# EAGLE design isstracker (EAGLE 9.6.2)

## Sheet 1 of 2
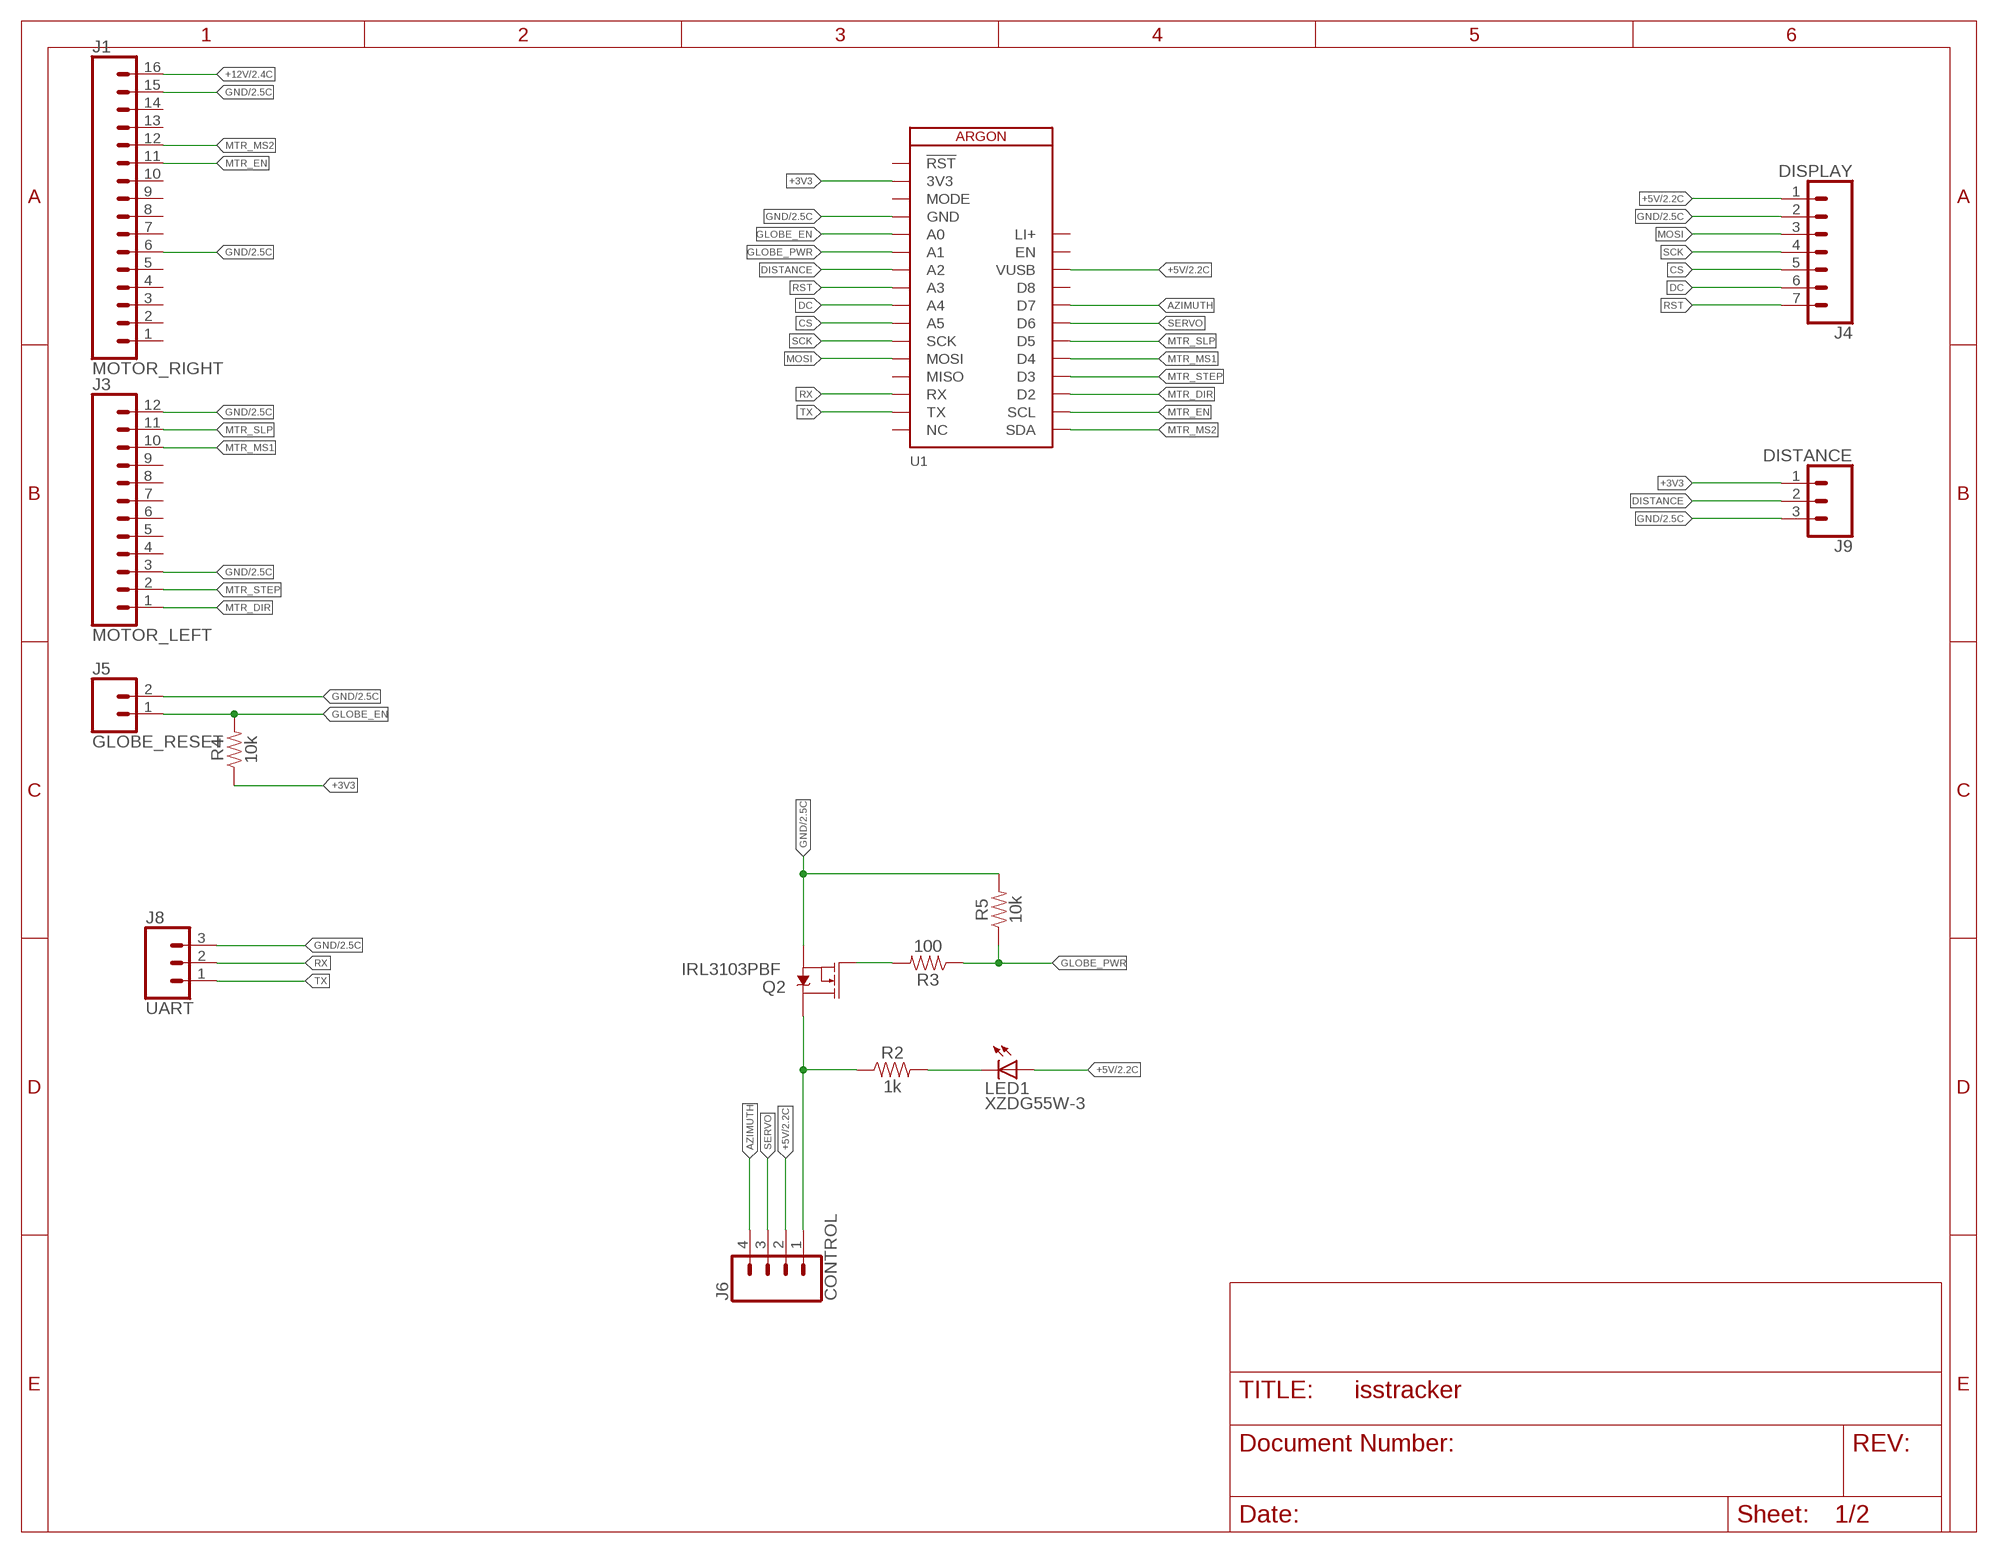
[diagram p0: schematic, sheet 1]

### Parts
J1  MOTOR_RIGHT  CONN_16  [1X16]
J3  MOTOR_LEFT  CONN_12  [1X12]
J4  DISPLAY  CONN_07  [1X07]
J5  GLOBE_RESET  CONN_02  [1X02]
J6  CONTROL  CONN_04  [1X04]
J8  UART  CONN_03  [1X03]
J9  DISTANCE  CONN_03  [1X03]
LED1  XZDG55W-3  LEDCHIPLED_1206  [CHIPLED_1206]
Q2  IRL3103PBF  MOSFET-NCH-FQP30N06L  [TO220V]
R2  1k  0.75OHM-0805-1/4W-1%  [0805]
R3  100  0.75OHM-0805-1/4W-1%  [0805]
R4  10k  0.75OHM-0805-1/4W-1%  [0805]
R5  10k  0.75OHM-0805-1/4W-1%  [0805]
U1  ARGON  [ARGON]

### Nets
+3V3: J9.1 R4.1 U1.2(3V3)
+5V: J4.1 J6.2 LED1.A U1.26(VUSB) ; also sheet 2
+12V: J1.16 ; also sheet 2
AZIMUTH: J6.4 U1.24(D7)
CS: J4.5 U1.10(A5)
DC: J4.6 U1.9(A4)
DISTANCE: J9.2 U1.7(A2)
GLOBE_EN: J5.1 R4.2 U1.5(A0)
GLOBE_PWR: R3.1 R5.1 U1.6(A1)
GND: J1.6 J1.15 J3.3 J3.12 J4.2 J5.2 J8.3 J9.3 Q2.3(S) R5.2 U1.4(GND) ; also sheet 2
MOSI: J4.3 U1.12(MOSI)
MTR_DIR: J3.1 U1.19(D2)
MTR_EN: J1.11 U1.18(SCL)
MTR_MS1: J3.10 U1.21(D4)
MTR_MS2: J1.12 U1.17(SDA)
MTR_SLP: J3.11 U1.22(D5)
MTR_STEP: J3.2 U1.20(D3)
N$3: Q2.1(G) R3.2
N$4: LED1.C R2.2
N$8: J6.1 Q2.2(D) R2.1
RST: J4.7 U1.8(A3)
RX: J8.2 U1.14(RX)
SCK: J4.4 U1.11(SCK)
SERVO: J6.3 U1.23(D6)
TX: J8.1 U1.15(TX)
Unconnected: J1.1 J1.2 J1.3 J1.4 J1.5 J1.7 J1.8 J1.9 J1.10 J1.13 J1.14 J3.4 J3.5 J3.6 J3.7 J3.8 J3.9 U1.1(!RST) U1.3(MODE) U1.13(MISO) U1.16(NC) U1.25(D8) U1.27(EN)

## Sheet 2 of 2
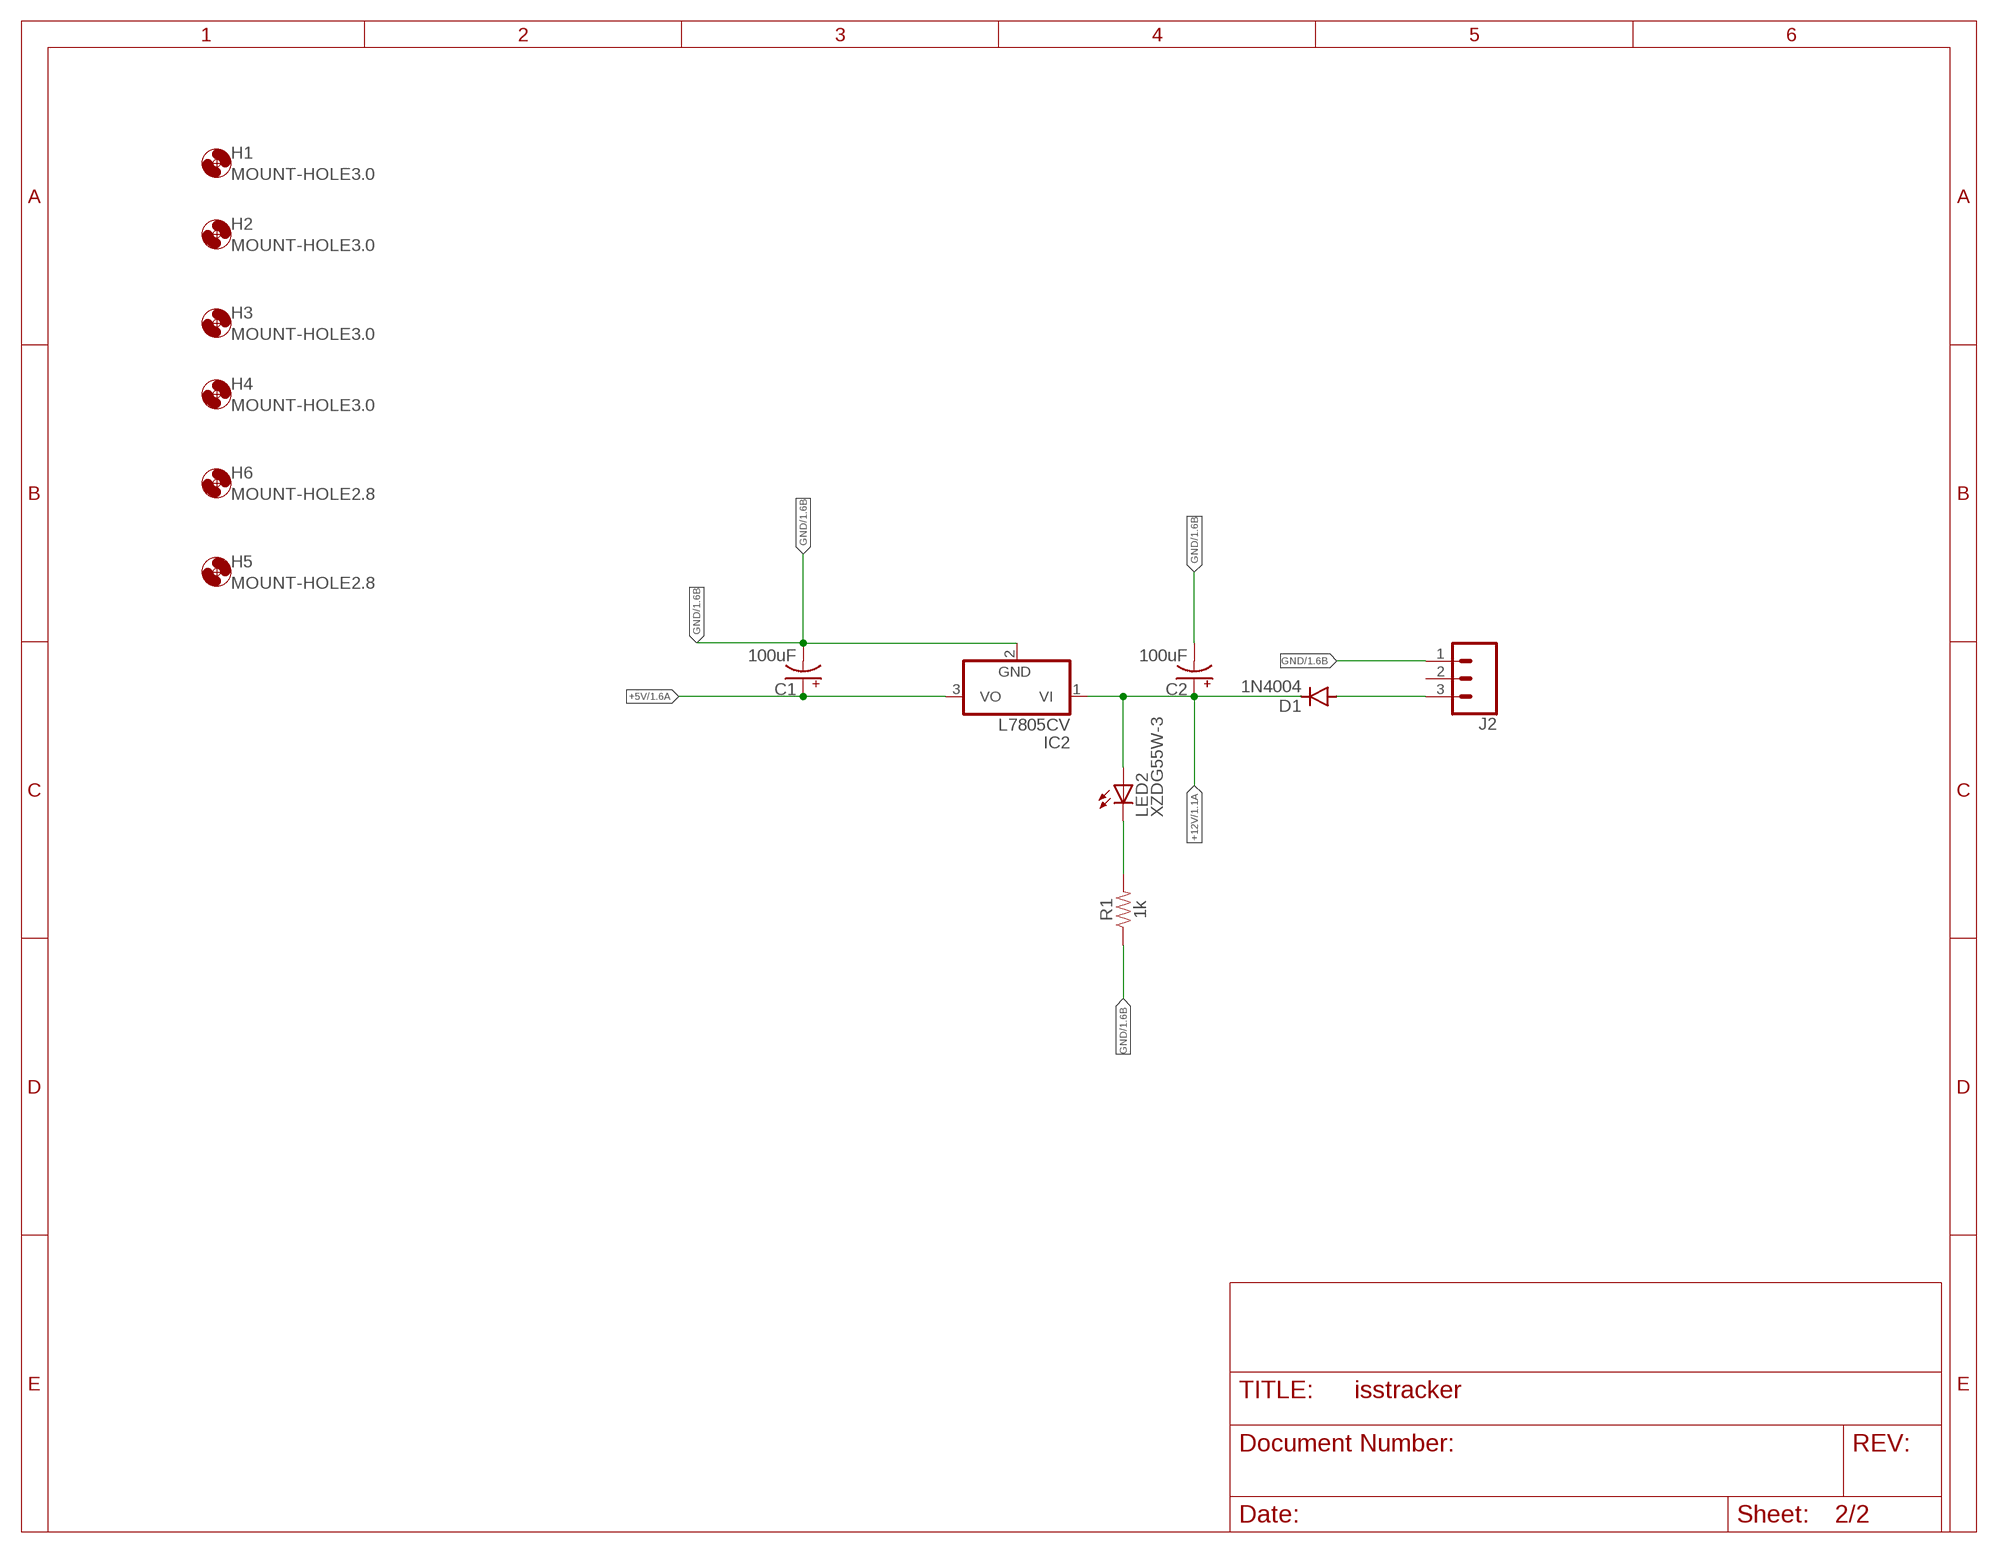
[diagram p1: schematic, sheet 2]

### Parts
C1  100uF  100UF-POLAR-RADIAL-2.5MM-25V-20%  [CPOL-RADIAL-2.5MM-6.5MM]
C2  100uF  100UF-POLAR-RADIAL-2.5MM-25V-20%  [CPOL-RADIAL-2.5MM-6.5MM]
D1  1N4004  [DO41-10]
H1  MOUNT-HOLE3.0  [3,0]
H2  MOUNT-HOLE3.0  [3,0]
H3  MOUNT-HOLE3.0  [3,0]
H4  MOUNT-HOLE3.0  [3,0]
H5  MOUNT-HOLE2.8  [2,8]
H6  MOUNT-HOLE2.8  [2,8]
IC2  L7805CV  7805TV  [TO220V]
J2  CONN_03LOCK_LONGPADS  [1X03_LOCK_LONGPADS]
LED2  XZDG55W-3  LEDCHIPLED_1206  [CHIPLED_1206]
R1  1k  0.3OHM-0805-1/8W-1%  [0805]

### Nets
+5V: C1.1(+) IC2.3(VO) ; also sheet 1
+12V: C2.1(+) D1.C IC2.1(VI) LED2.A ; also sheet 1
GND: C1.2(-) C2.2(-) IC2.2(GND) J2.1 R1.1 ; also sheet 1
N$1: D1.A J2.3
N$2: LED2.C R1.2
Unconnected: J2.2

## Power pins joined to a net without a drawn wire
LI+: U1.28(LI+)

## Library data of the parts
C1 C2 = SparkFun-Capacitors:100UF-POLAR: 100µF polarized capacitors A capacitor is a passive two-terminal electrical component used to store electrical energy temporarily in an electric field.; PROD_ID: CAP-08439
D1 = diode:1N4004: DIODE general purpose rectifier, 1 A
H1-H6 = holes:MOUNT-HOLE: MOUNTING HOLE with drill center marker
IC2 = linear:78*: Positive VOLTAGE REGULATOR Source: http://cache.national.com/ds/LM/LM78L05.pdf http://www.fairchildsemi.com/ds/LM/LM7805.pdf
J1 = SparkFun-Connectors:CONN_16: Multi connection point. Often used as Generic Header-pin footprint for 0.1 inch spaced/style header connections On any of the 0.1 inch spaced packages, you can populate with these: Break Away Headers - Straight <https://www.sparkfun.com/products/116> (PRT-00116) Break Away Male Headers - Right Angle <https://www.sparkfun.com/products/553> (PRT-00553) Female Headers <https://www.sparkfun.com/products/115> (PRT-00115) Break Away Headers - Machine Pin <https://www.sparkfun.com/products/117> (PRT-00117) Break Away Female Headers - Swiss Machine Pin <https://www.sparkfun.com/products/743> (PRT-00743) For SCREWTERMINALS and SPRING TERMINALS visit here: Screw Terimnals on SparkFun.com <https://www.sparkfun.com/search/results?term=Screw+Terminals> (5mm/3.5mm/2.54mm spacing) This device is also useful as a general connection point to wire up your design to another part of your project. Our various solder wires solder well into these plated through hole pads. Hook-Up Wire - Assortment (Stranded, 22 AWG) <https://www.sparkfun.com/products/11375> (PRT-11375) Hook-Up Wire - Assortment (Solid Core, 22 AWG) <https://www.sparkfun.com/products/11367> (PRT-11367) View the entire wire category on our website here <https://www.sparkfun.com/categories/141> Special notes: Molex polarized connector foot print use with SKU : PRT-08231 with associated crimp pins and housings. 1MM SMD Version SKU: PRT-10208 NOTES ON THE VARIANTS LOCK and LOCK_LONGPADS... This footprint was designed to help hold the alignment of a through-hole component (i.e. 6-pin header) while soldering it into place. You may notice that each hole has been shifted either up or down by 0.005 of an inch from it's more standard position (which is a perfectly straight line). This slight alteration caused the pins (the squares in the middle) to touch the edges of the holes. Because they are alternating, it causes a "brace" to hold the component in place. 0.005 has proven to be the perfect amount of "off-center" position when using our standard breakaway headers. Although looks a little odd when you look at the bare footprint, once you have a header in there, the alteration is very hard to notice. Also,if you push a header all the way into place, it is covered up entirely on the bottom side.
J2 J8 J9 = SparkFun-Connectors:CONN_03: Multi connection point. Often used as Generic Header-pin footprint for 0.1 inch spaced/style header connections On any of the 0.1 inch spaced packages, you can populate with these: Break Away Headers - Straight <https://www.sparkfun.com/products/116> (PRT-00116) Break Away Male Headers - Right Angle <https://www.sparkfun.com/products/553> (PRT-00553) Female Headers <https://www.sparkfun.com/products/115> (PRT-00115) Break Away Headers - Machine Pin <https://www.sparkfun.com/products/117> (PRT-00117) Break Away Female Headers - Swiss Machine Pin <https://www.sparkfun.com/products/743> (PRT-00743) Stackable Header - 3 Pin (Female, 0.1") <https://www.sparkfun.com/products/13875> (PRT-13875) For SCREWTERMINALS and SPRING TERMINALS visit here: Screw Terimnals on SparkFun.com <https://www.sparkfun.com/search/results?term=Screw+Terminals> (5mm/3.5mm/2.54mm spacing) This device is also useful as a general connection point to wire up your design to another part of your project. Our various solder wires solder well into these plated through hole pads. Hook-Up Wire - Assortment (Stranded, 22 AWG) <https://www.sparkfun.com/products/11375> (PRT-11375) Hook-Up Wire - Assortment (Solid Core, 22 AWG) <https://www.sparkfun.com/products/11367> (PRT-11367) View the entire wire category on our website here <https://www.sparkfun.com/categories/141> Special notes: Molex polarized connector foot print use with SKU : PRT-08232 with associated crimp pins and housings.
J3 = SparkFun-Connectors:CONN_12: Multi connection point. Often used as Generic Header-pin footprint for 0.1 inch spaced/style header connections On any of the 0.1 inch spaced packages, you can populate with these: Break Away Headers - Straight <https://www.sparkfun.com/products/116> (PRT-00116) Break Away Male Headers - Right Angle <https://www.sparkfun.com/products/553> (PRT-00553) Female Headers <https://www.sparkfun.com/products/115> (PRT-00115) Break Away Headers - Machine Pin <https://www.sparkfun.com/products/117> (PRT-00117) Break Away Female Headers - Swiss Machine Pin <https://www.sparkfun.com/products/743> (PRT-00743) For SCREWTERMINALS and SPRING TERMINALS visit here: Screw Terimnals on SparkFun.com <https://www.sparkfun.com/search/results?term=Screw+Terminals> (5mm/3.5mm/2.54mm spacing) This device is also useful as a general connection point to wire up your design to another part of your project. Our various solder wires solder well into these plated through hole pads. Hook-Up Wire - Assortment (Stranded, 22 AWG) <https://www.sparkfun.com/products/11375> (PRT-11375) Hook-Up Wire - Assortment (Solid Core, 22 AWG) <https://www.sparkfun.com/products/11367> (PRT-11367) View the entire wire category on our website here <https://www.sparkfun.com/categories/141> Special notes: Molex polarized connector foot print use with SKU : PRT-08231 with associated crimp pins and housings. 1MM SMD Version SKU: PRT-10208 NOTES ON THE VARIANTS LOCK and LOCK_LONGPADS... This footprint was designed to help hold the alignment of a through-hole component (i.e. 6-pin header) while soldering it into place. You may notice that each hole has been shifted either up or down by 0.005 of an inch from it's more standard position (which is a perfectly straight line). This slight alteration caused the pins (the squares in the middle) to touch the edges of the holes. Because they are alternating, it causes a "brace" to hold the component in place. 0.005 has proven to be the perfect amount of "off-center" position when using our standard breakaway headers. Although looks a little odd when you look at the bare footprint, once you have a header in there, the alteration is very hard to notice. Also,if you push a header all the way into place, it is covered up entirely on the bottom side.
J4 = SparkFun-Connectors:CONN_07: Multi connection point. Often used as Generic Header-pin footprint for 0.1 inch spaced/style header connections On any of the 0.1 inch spaced packages, you can populate with these: Break Away Headers - Straight <https://www.sparkfun.com/products/116> (PRT-00116) Break Away Male Headers - Right Angle <https://www.sparkfun.com/products/553> (PRT-00553) Female Headers <https://www.sparkfun.com/products/115> (PRT-00115) Break Away Headers - Machine Pin <https://www.sparkfun.com/products/117> (PRT-00117) Break Away Female Headers - Swiss Machine Pin <https://www.sparkfun.com/products/743> (PRT-00743) For SCREWTERMINALS and SPRING TERMINALS visit here: Screw Terimnals on SparkFun.com <https://www.sparkfun.com/search/results?term=Screw+Terminals> (5mm/3.5mm/2.54mm spacing) This device is also useful as a general connection point to wire up your design to another part of your project. Our various solder wires solder well into these plated through hole pads. Hook-Up Wire - Assortment (Stranded, 22 AWG) <https://www.sparkfun.com/products/11375> (PRT-11375) Hook-Up Wire - Assortment (Solid Core, 22 AWG) <https://www.sparkfun.com/products/11367> (PRT-11367) View the entire wire category on our website here <https://www.sparkfun.com/categories/141> Special notes: Molex polarized connector foot print use with SKU : PRT-08231 with associated crimp pins and housings. 1MM SMD Version SKU: PRT-10208 NOTES ON THE VARIANTS LOCK and LOCK_LONGPADS... This footprint was designed to help hold the alignment of a through-hole component (i.e. 6-pin header) while soldering it into place. You may notice that each hole has been shifted either up or down by 0.005 of an inch from it's more standard position (which is a perfectly straight line). This slight alteration caused the pins (the squares in the middle) to touch the edges of the holes. Because they are alternating, it causes a "brace" to hold the component in place. 0.005 has proven to be the perfect amount of "off-center" position when using our standard breakaway headers. Although looks a little odd when you look at the bare footprint, once you have a header in there, the alteration is very hard to notice. Also,if you push a header all the way into place, it is covered up entirely on the bottom side.
J5 = SparkFun-Connectors:CONN_02: Multi connection point. Often used as Generic Header-pin footprint for 0.1 inch spaced/style header connections On any of the 0.1 inch spaced packages, you can populate with these: Break Away Headers - Straight <https://www.sparkfun.com/products/116> (PRT-00116) Break Away Male Headers - Right Angle <https://www.sparkfun.com/products/553> (PRT-00553) Female Headers <https://www.sparkfun.com/products/115> (PRT-00115) Break Away Headers - Machine Pin <https://www.sparkfun.com/products/117> (PRT-00117) Break Away Female Headers - Swiss Machine Pin <https://www.sparkfun.com/products/743> (PRT-00743) For SCREWTERMINALS and SPRING TERMINALS visit here: Screw Terimnals on SparkFun.com <https://www.sparkfun.com/search/results?term=Screw+Terminals> (5mm/3.5mm/2.54mm spacing) This device is also useful as a general connection point to wire up your design to another part of your project. Our various solder wires solder well into these plated through hole pads. Hook-Up Wire - Assortment (Stranded, 22 AWG) <https://www.sparkfun.com/products/11375> (PRT-11375) Hook-Up Wire - Assortment (Solid Core, 22 AWG) <https://www.sparkfun.com/products/11367> (PRT-11367) View the entire wire category on our website here <https://www.sparkfun.com/categories/141> Special notes: Molex polarized connector foot print use with: PRT-08233 with associated crimp pins and housings. 2.54_SCREWTERM for use with PRT-10571. 3.5mm Screw Terminal footprints for PRT-08084 5mm Screw Terminal footprints for use with PRT-08432
J6 = SparkFun-Connectors:CONN_04: Multi connection point. Often used as Generic Header-pin footprint for 0.1 inch spaced/style header connections On any of the 0.1 inch spaced packages, you can populate with these: Break Away Headers - Straight <https://www.sparkfun.com/products/116> (PRT-00116) Break Away Male Headers - Right Angle <https://www.sparkfun.com/products/553> (PRT-00553) Female Headers <https://www.sparkfun.com/products/115> (PRT-00115) Break Away Headers - Machine Pin <https://www.sparkfun.com/products/117> (PRT-00117) Break Away Female Headers - Swiss Machine Pin <https://www.sparkfun.com/products/743> (PRT-00743) For SCREWTERMINALS and SPRING TERMINALS visit here: Screw Terimnals on SparkFun.com <https://www.sparkfun.com/search/results?term=Screw+Terminals> (5mm/3.5mm/2.54mm spacing) This device is also useful as a general connection point to wire up your design to another part of your project. Our various solder wires solder well into these plated through hole pads. Hook-Up Wire - Assortment (Stranded, 22 AWG) <https://www.sparkfun.com/products/11375> (PRT-11375) Hook-Up Wire - Assortment (Solid Core, 22 AWG) <https://www.sparkfun.com/products/11367> (PRT-11367) View the entire wire category on our website here <https://www.sparkfun.com/categories/141> Special notes: Molex polarized connector foot print use with SKU : PRT-08231 with associated crimp pins and housings. 1MM SMD Version SKU: PRT-10208; PROD_ID: CONN-09696
LED1 LED2 = adafruit:LED: LED OSRAM: - CHIPLED LG R971, LG N971, LY N971, LG Q971, LY Q971, LO R971, LY R971 LH N974, LH R974 LS Q976, LO Q976, LY Q976 LO Q996 - Hyper CHIPLED LW Q18S LB Q993, LB Q99A, LB R99A - SideLED LS A670, LO A670, LY A670, LG A670, LP A670 LB A673, LV A673, LT A673, LW A673 LH A674 LY A675 LS A676, LA A676, LO A676, LY A676, LW A676 LS A679, LY A679, LG A679 - Hyper Micro SIDELED® LS Y876, LA Y876, LO Y876, LY Y876 LT Y87S - SmartLED LW L88C, LW L88S LB L89C, LB L89S, LG L890 LS L89K, LO L89K, LY L89K LS L896, LA L896, LO L896, LY L896 - TOPLED LS T670, LO T670, LY T670, LG T670, LP T670 LSG T670, LSP T670, LSY T670, LOP T670, LYG T670 LG T671, LOG T671, LSG T671 LB T673, LV T673, LT T673, LW T673 LH T674 LS T676, LA T676, LO T676, LY T676, LB T676, LH T676, LSB T676, LW T676 LB T67C, LV T67C, LT T67C, LS T67K, LO T67K, LY T67K, LW E67C LS E67B, LA E67B, LO E67B, LY E67B, LB E67C, LV E67C, LT E67C LW T67C LS T679, LY T679, LG T679 LS T770, LO T770, LY T770, LG T770, LP T770 LB T773, LV T773, LT T773, LW T773 LH T774 LS E675, LA E675, LY E675, LS T675 LS T776, LA T776, LO T776, LY T776, LB T776 LHGB T686 LT T68C, LB T68C - Hyper Mini TOPLED® LB M676 - Mini TOPLED Santana® LG M470 LS M47K, LO M47K, LY M47K Source: http://www.osram.convergy.de/
Q2 = SparkFun-DiscreteSemi:MOSFET-NCH: N-channel MOSFETs Voltage controlled devices that allow control of high current outputs. SparkFun Products: SparkFun OpenScale <https://www.sparkfun.com/products/13261> SparkFun Digital Sandbox <https://www.sparkfun.com/products/12651> SparkFun Monster Moto Shield <https://www.sparkfun.com/products/10182> SparkFun MOSFET Power Controller <https://www.sparkfun.com/products/11214>; PROD_ID: TRANS-10060; VALUE: 60V/32A/35mΩ
R1 = SparkFun-Resistors:0.3OHM: 0.3Ω resistor A resistor is a passive two-terminal electrical component that implements electrical resistance as a circuit element. Resistors act to reduce current flow, and, at the same time, act to lower voltage levels within circuits. - Wikipedia; PROD_ID: RES-11622; VALUE: 0.3
R2-R5 = SparkFun-Resistors:0.75OHM: 0.75Ω resistor A resistor is a passive two-terminal electrical component that implements electrical resistance as a circuit element. Resistors act to reduce current flow, and, at the same time, act to lower voltage levels within circuits. - Wikipedia; PROD_ID: RES-08474; VALUE: 0.75
U1 = Particle-Devices:ARGON: ARGON The Particle Argon is a powerful Wi-Fi development kit that you can use as a standalone Wi-Fi device or Wi-Fi enabled gateway, repeater, or endpoint for Particle Mesh networks. More information: https://docs.particle.io/argon/ Footprint and formfactor based on Adafruit Feather. <https://www.adafruit.com/feather>

## Board
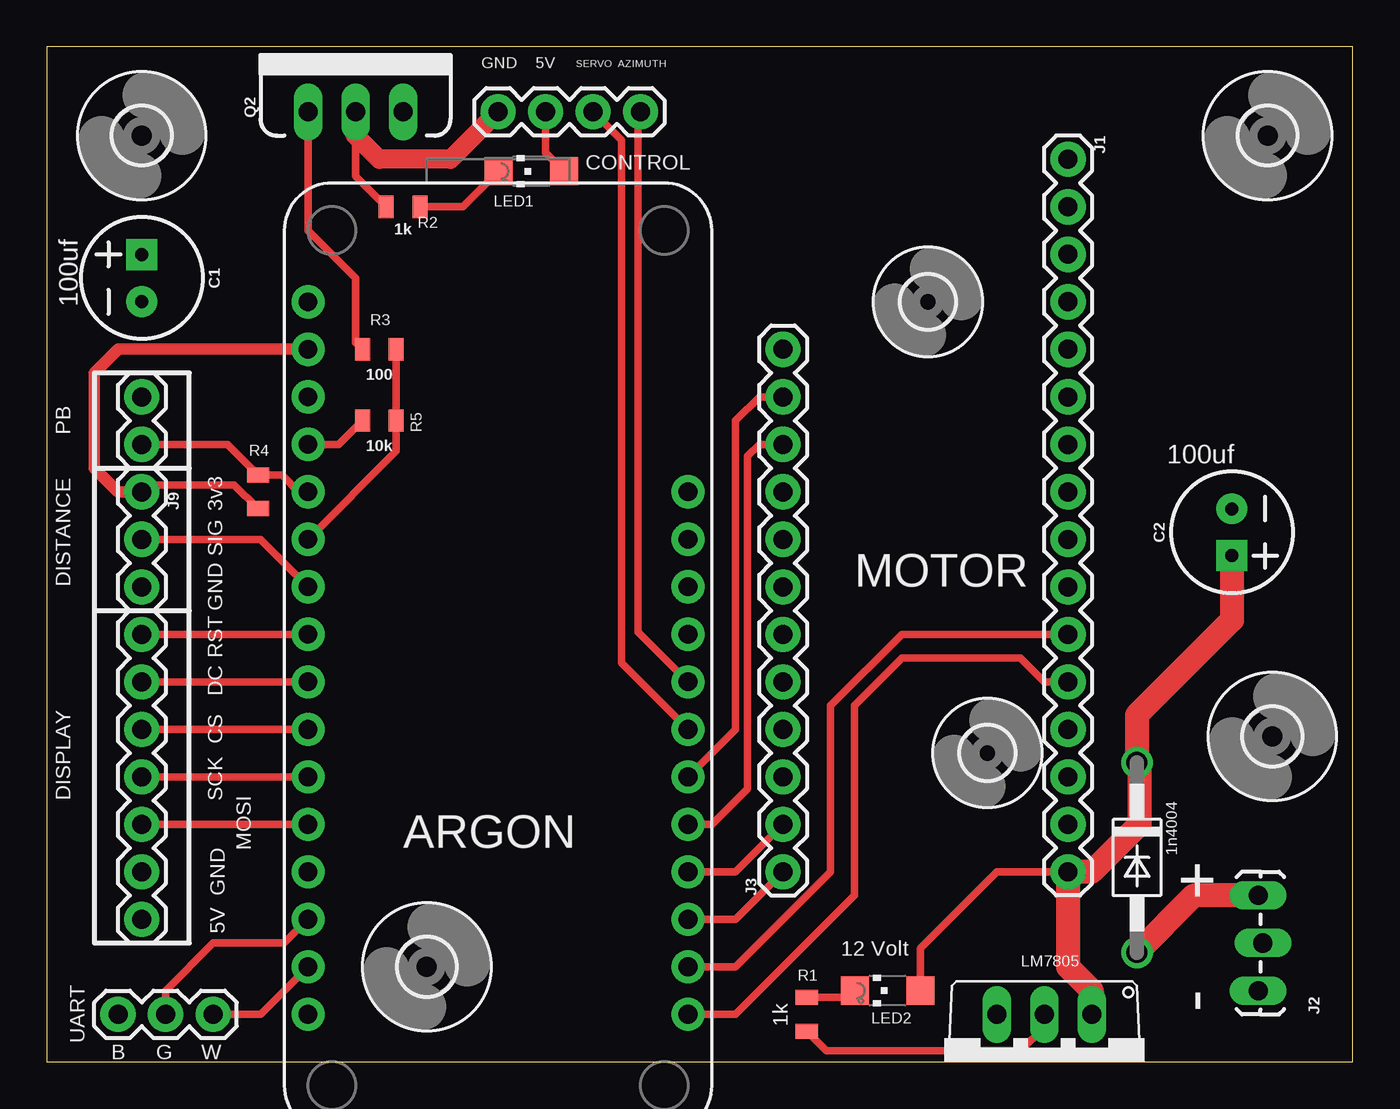
[diagram p2: board, top side]
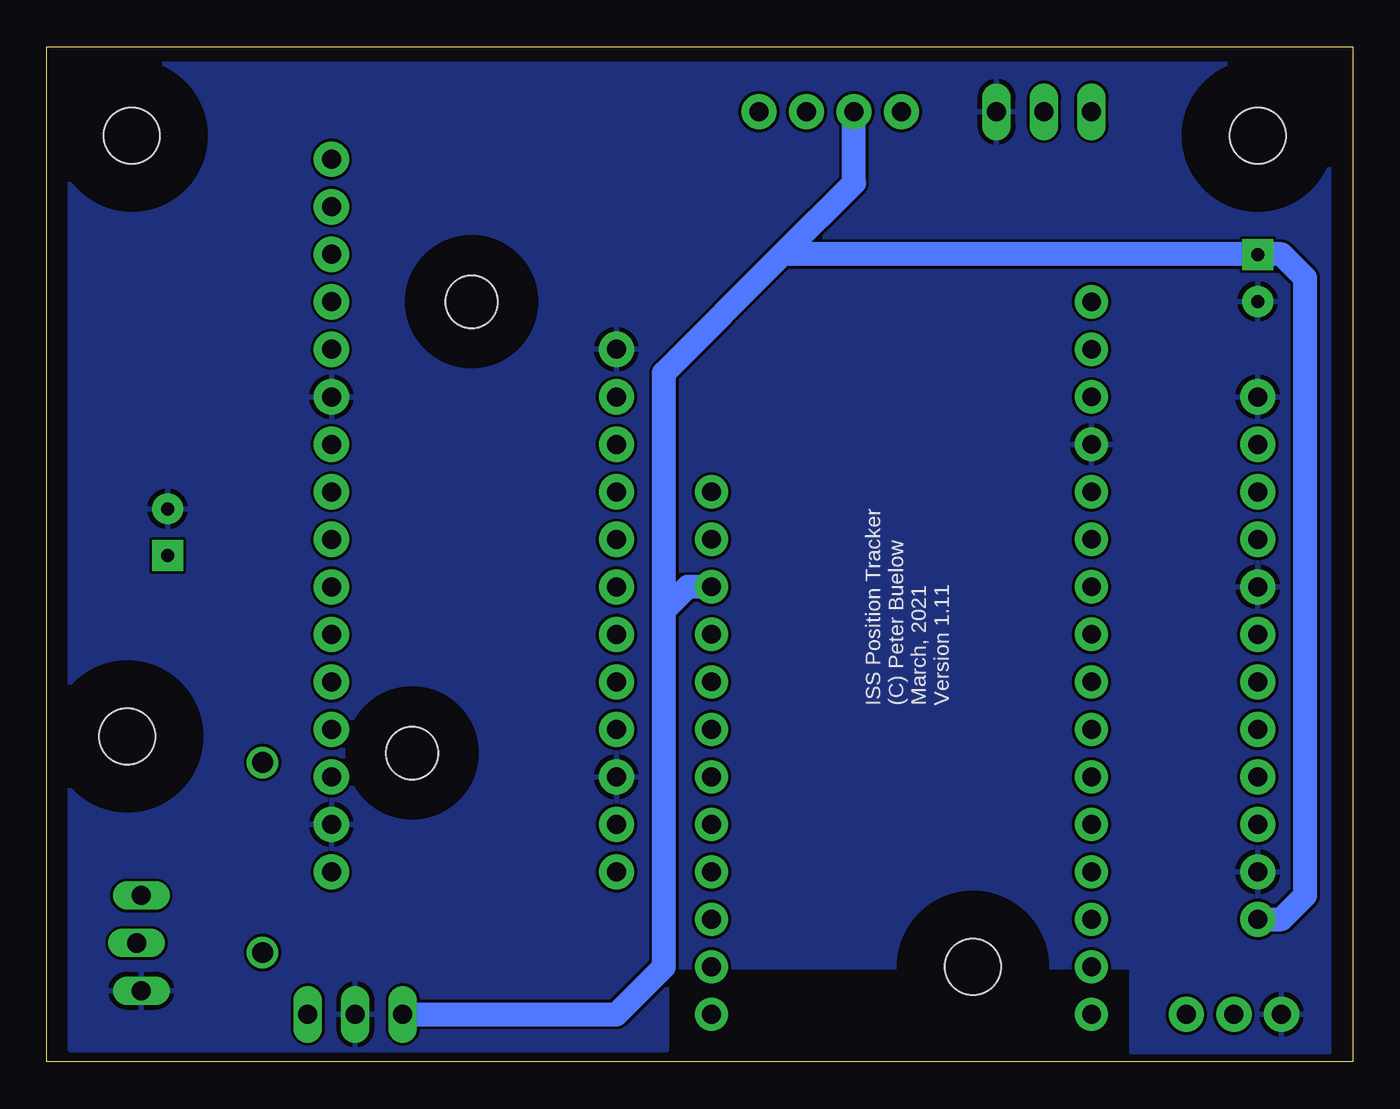
[diagram p3: board, bottom side, seen from below]

Size 69.83 x 54.28 mm. Coordinates in mm from the lower left corner, seen from the top.
Outline: 0,0 69.83,0 69.83,54.28 0,54.28 0,0
Copper layers (1*16): Top 0.035559375mm / dielectric 1.6mm / Bottom 0.035559375mm
Design rules "oshpark-2layer": minimum track width 6mil, minimum drill 10mil, track to track 6mil, track to pad 6mil, pad to pad 6mil, via to via 6mil, smd to smd 6mil, copper to edge 15mil, drill to drill 6mil, minimum pad ring 5mil, minimum via ring 5mil, stop-mask expansion 2.5mil, vias tented up to drill 0mil, thermal gap 10mil

### Footprints (pad centres in the part's own frame; a part is rotated, then mirrored left to right if it is on the bottom)
CPOL-RADIAL-2.5MM-6.5MM = drill 0.7 pad 1.651 square: 1 1.25,0 | drill 0.7 pad 1.651: 2 -1.25,0
DO41-10 = drill 1.118: A 5.08,0; C -5.08,0
3,0 = hole 3: 0,0
2,8 = hole 2.8: 0,0
TO220V = drill 1.016 long: 1 -2.54,-2.54; 2 0,-2.54; 3 2.54,-2.54
1X16 = drill 1.016 pad 1.88: 1 0,0; 2 2.54,0; 3 5.08,0; 4 7.62,0; 5 10.16,0; 6 12.7,0; 7 15.24,0; 8 17.78,0; 9 20.32,0; 10 22.86,0; 11 25.4,0; 12 27.94,0; 13 30.48,0; 14 33.02,0; 15 35.56,0; 16 38.1,0
1X03_LOCK_LONGPADS = drill 1.016 long: 1 0,0; 2 2.54,-0.254; 3 5.08,0
1X12 = drill 1.016 pad 1.88: 1 0,0; 2 2.54,0; 3 5.08,0; 4 7.62,0; 5 10.16,0; 6 12.7,0; 7 15.24,0; 8 17.78,0; 9 20.32,0; 10 22.86,0; 11 25.4,0; 12 27.94,0
1X07 = drill 1.016 pad 1.88: 1 0,0; 2 2.54,0; 3 5.08,0; 4 7.62,0; 5 10.16,0; 6 12.7,0; 7 15.24,0
1X02 = drill 1.016 pad 1.88: 1 0,0; 2 2.54,0
1X04 = drill 1.016 pad 1.88: 1 0,0; 2 2.54,0; 3 5.08,0; 4 7.62,0
1X03 = drill 1.016 pad 1.88: 1 0,0; 2 2.54,0; 3 5.08,0
CHIPLED_1206 = smd 1.5 x 1.5: A 0,-1.75; C 0,1.75
TO220V' = drill 1.016 long: 1 -2.54,0; 2 0,0; 3 2.54,0
0805 = smd 0.8 x 1.2: 1 -0.9,0; 2 0.9,0
ARGON = drill 1 pad 1.778: 1 1.27,44.45; 2 1.27,41.91; 3 1.27,39.37; 4 1.27,36.83; 5 1.27,34.29; 6 1.27,31.75; 7 1.27,29.21; 8 1.27,26.67; 9 1.27,24.13; 10 1.27,21.59; 11 1.27,19.05; 12 1.27,16.51; 13 1.27,13.97; 14 1.27,11.43; 15 1.27,8.89; 16 1.27,6.35; 17 21.59,6.35; 18 21.59,8.89; 19 21.59,11.43; 20 21.59,13.97; 21 21.59,16.51; 22 21.59,19.05; 23 21.59,21.59; 24 21.59,24.13; 25 21.59,26.67; 26 21.59,29.21; 27 21.59,31.75; 28 21.59,34.29

### Placement (x,y rotation side)
C1  5.08,41.91 90 top
C2  63.37,28.32 270 top
D1  58.29,10.92 270 top
H1  20.32,5.08 0 top
H2  65.53,17.4 0 top
H3  65.28,49.53 0 top
H4  5.08,49.53 0 top
H5  50.29,16.51 0 top
H6  47.12,40.64 0 top
IC2  53.34,0 180 top
J1  54.61,48.26 270 top
J2  64.77,3.81 90 top
J3  39.37,10.16 90 top
J4  5.08,7.62 90 top
J5  5.08,33.02 90 top
J6  24.13,50.8 0 top
J8  8.89,2.54 180 top
J9  5.08,30.48 270 top
LED1  25.91,47.62 90 top
LED2  44.96,3.81 90 top
Q2  IRL3103PBF  [TO220V']  16.51,50.8 0 top
R1  40.64,2.54 90 top
R2  19.05,45.72 0 top
R3  17.78,38.1 180 top
R4  11.3,30.48 90 top
R5  17.78,34.29 180 top
U1  12.7,-3.81 0 top

### Tracks (layer width: path | path; a pad name or v marks a point on that pad's centre or on a via)
+3V3
  Top 0.406: J9.1 5.45,30.85 10.03,30.85 R4.1
  Top 0.61: J9.1 3.81,30.48 2.54,31.75 2.54,36.83 3.81,38.1 U1.2
+5V
  Top 0.406: J6.2 26.67,48.61 LED1.A
  Bottom 1.27: IC2.3 39.37,2.54 36.83,5.08 36.83,24.13 | 30.48,43.18 36.83,36.83 36.83,24.13 | 30.48,43.18 26.67,46.99 J6.2 | U1.26 35.56,25.4 36.83,24.13 | 30.48,43.18 5.1,43.18 C1.1 5.06,43.18 3.81,43.18 2.54,41.91 2.54,8.89 3.81,7.62 J4.1
+12V
  Top 0.406: LED2.A 46.71,6.07 50.8,10.16 J1.16
  Top 1.27: IC2.1 55.88,3.81 54.61,5.08 J1.16 55.88,10.16 58.42,12.7 58.42,15.88 D1.C 58.29,18.54 63.37,23.62 C2.1
AZIMUTH
  Top 0.406: U1.24 31.62,22.99 31.62,50.67 J6.4
CS
  Top 0.406: U1.10 J4.5
DC
  Top 0.406: U1.9 J4.6
DISTANCE
  Top 0.406: J9.2 11.43,27.94 U1.7
GLOBE_EN
  Top 0.406: J5.1 9.66,33.02 R4.2 12.57,31.38 13.47,30.48 U1.5
GLOBE_PWR
  Top 0.406: U1.6 18.68,32.65 R5.1 R3.1
GND
  Top 0.406: R1.1 41.7,0.58 52.07,0.58 53.34,1.85 IC2.2 | U1.4 15.61,33.02 R5.2
  pour Bottom: 1.27,53.34 1.27,0.51 11.81,0.51 11.81,5.08 36.7,5.08 36.7,0.64 68.58,0.64 68.58,53.34
MOSI
  Top 0.406: U1.12 J4.3
MTR_DIR
  Top 0.406: U1.19 36.83,7.62 J3.1
MTR_EN
  Top 0.406: U1.18 36.83,5.08 41.91,10.16 41.91,19.05 45.72,22.86 J1.11
MTR_MS1
  Top 0.406: U1.21 35.56,12.7 37.47,14.61 37.47,32.38 38.1,33.02 J3.10
MTR_MS2
  Top 0.406: U1.17 36.83,2.54 43.18,8.89 43.18,19.05 45.72,21.59 52.07,21.59 53.34,20.32 J1.12
MTR_SLP
  Top 0.406: U1.22 36.83,17.78 36.83,34.29 38.1,35.56 J3.11
MTR_STEP
  Top 0.406: U1.20 36.83,10.16 J3.2
N$1
  Top 1.27: D1.A 61.34,8.89 J2.3
N$2
  Top 0.406: LED2.C 42.84,3.44 R1.2
N$3
  Top 0.406: R3.2 16.51,38.47 16.51,41.91 13.97,44.45 Q2.1
N$4
  Top 0.406: LED1.C 22.25,45.72 R2.2
N$8
  Top 0.406: R2.1 16.51,47.36 Q2.2
  Top 1.016: J6.1 21.59,48.26 17.78,48.26 16.51,49.53 Q2.2
RST
  Top 0.406: U1.8 J4.7
RX
  Top 0.406: U1.14 12.7,6.35 8.89,6.35 6.35,3.81 J8.2
SCK
  Top 0.406: U1.11 J4.4
SERVO
  Top 0.406: J6.3 30.73,49.28 30.73,21.34 U1.23
TX
  Top 0.406: J8.1 11.43,2.54 U1.15

### Text on the board
_tsilk: GND | 5V | SERVO | AZIMUTH | CONTROL | LED1 | R2 | 100uf | R3 | PB | R5 | 100uf | R4 | 3v3 | SIG | DISTANCE | MOTOR | GND | RST | DC | CS | DISPLAY | SCK | MOSI | ARGON | 1n4004 | GND | + | 5V | 12 Volt | LM7805 | R1 | - | 1k | LED2 | UART | B | G | W
_bsilk: ISS Position Tracker / (C) Peter Buelow / March, 2021 / Version 1.11